# Altium schematic sheet Pulse_WS_MAX30105.SchDoc
size A4; SheetNumber: 1; SheetTotal: 1
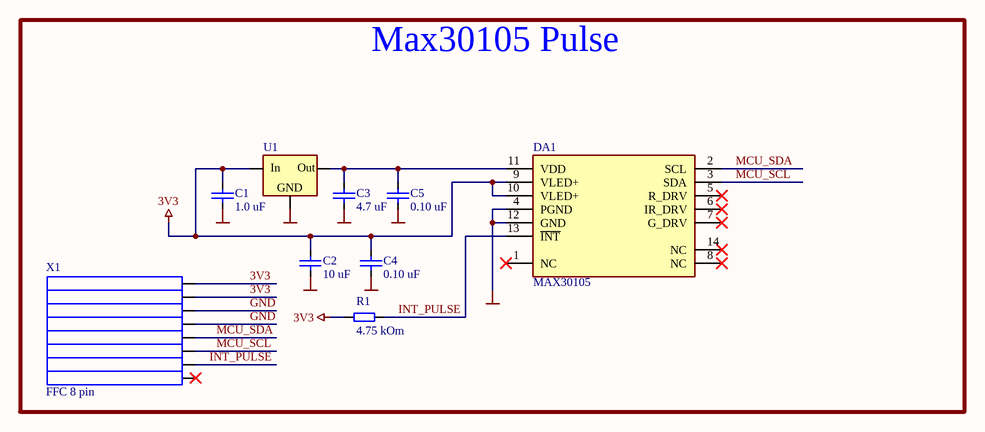
[diagram p0: Pulse_WS_MAX30105.SchDoc]

## Parts
C1  value 1.0 uF  [CAPC1608X90N]  (hidden comment: STD_CAP)
C2  value 10 uF  [CAPC2012X120N]  (hidden comment: STD_CAP)
C3  value 4.7 uF  [CAPC2012X120N]  (hidden comment: STD_CAP)
C4  value 0.10 uF  [CAPC1005X55N]  (hidden comment: STD_CAP)
C5  value 0.10 uF  [CAPC1005X55N]  (hidden comment: STD_CAP)
DA1  MAX30105  [MAX30105]
R1  value 4.75 kOm  [RESC1005X40N]  (hidden comment: STD_RES)
U1  XC6206P182MR  [SOT23]  (value not drawn)
X1  FFC 8 pin  [68710814022]

## Blocks framed on the sheet
Max30105 Pulse: C1-C5 DA1 R1 U1 X1

## Nets
3V3: C1.1 C2.1 C4.1 DA1.9(VLED+) DA1.10(VLED+) R1.1 U1.3 X1.1 X1.2
GND: C1.2 C2.2 C3.2 C4.2 C5.2 DA1.4(PGND) DA1.12(GND) U1.1 X1.3 X1.4
INT_PULSE: DA1.13(~{INT}) R1.2 X1.7
MCU_SCL: DA1.3(SDA) X1.6
MCU_SDA: DA1.2(SCL) X1.5
NetC3_1: C3.1 C5.1 DA1.11(VDD) U1.2

Not connected (* = marked no-connect by the designer): DA1 1(NC)* 5(R_DRV)* 6(IR_DRV)* 7(G_DRV)* 8(NC)* 14(NC)*; X1 8*

## Notes on the sheet
- (in symbol XC6206P182MR) In; Out; GND

## Library data of the parts
C1 = 3936: ManufacturerPartnumber: GRM188R71C105KA12D; Manufacturer: muRata; Number_Base: 3936; Comp_ID: 200004-0109; Lib_Description: Capacitor; Comp_Description: Capacitors 0603 1.0 uF ±10% 16V X7R; Human_Readable: Конденсатор 0603 1.0 uF ±10% 16V X7R; Precision: ±10%; Temp_Range: -55 to 125°C; Voltage_Range: 16V; Dielectric: X7R; Comp_Class_Number: 200004; Comp_Class_Name: Capacitors Chip SMD 0603; BOM: Конденсатор 0603 1.0 uF ±10% 16V X7R    GRM188R71C105KA12D muRata; Footprint_Description: Chip Capacitor EIA 0603. METRIC 1608, 2-Leads, Body 1,6x0,8mm, IPC Medium Density; HelpURL: \\corp1\RNDlibrary\_Library\Altium_lib\Datasheet\muRata\Chip_Monolithic_Ceramic_Capacitors\Chip_Monolithic_Ceramic_Capacitors.pdf; ComponentLink1Description: MANUFACTURER_URL; ComponentLink1URL: http://www.murata.com/products/catalog/pdf/c02e.pdf; Price: 0,0799999982118607; TimeModification_Comp: 06.12.2011 14:46:17
C2 = 4014: ManufacturerPartnumber: GRM21BR71A106KE51L; Manufacturer: muRata; Number_Base: 4014; Comp_ID: 200005-0069; Lib_Description: Capacitor; Comp_Description: Capacitors 0805 10 uF ±10% 10V X7R; Human_Readable: Конденсатор 0805 10 uF ±10% 10V X7R; Precision: ±10%; Temp_Range: -55 to 125°C; Voltage_Range: 10V; Dielectric: X7R; Comp_Class_Number: 200005; Comp_Class_Name: Capacitors Chip SMD 0805; BOM: Конденсатор 0805 10 uF ±10% 10V X7R    GRM21BR71A106KE51L muRata; Footprint_Description: Chip Capacitor EIA 0805. METRIC 2012, 2-Leads, Body 2,0x1,2mm, IPC Medium Density; HelpURL: \\corp1\RNDlibrary\_Library\Altium_lib\Datasheet\muRata\Chip_Monolithic_Ceramic_Capacitors\Chip_Monolithic_Ceramic_Capacitors.pdf; ComponentLink1Description: MANUFACTURER_URL; ComponentLink1URL: http://www.murata.com/products/catalog/pdf/c02e.pdf; TimeModification_Comp: 07.12.2011 12:55:51
C3 = 4013: ManufacturerPartnumber: GRM21BR71A475KA73L; Manufacturer: muRata; Number_Base: 4013; Comp_ID: 200005-0068; Lib_Description: Capacitor; Comp_Description: Capacitors 0805 4.7 uF ±10% 10V X7R; Human_Readable: Конденсатор 0805 4.7 uF ±10% 10V X7R; Precision: ±10%; Temp_Range: -55 to 125°C; Voltage_Range: 10V; Dielectric: X7R; Comp_Class_Number: 200005; Comp_Class_Name: Capacitors Chip SMD 0805; BOM: Конденсатор 0805 4.7 uF ±10% 10V X7R    GRM21BR71A475KA73L muRata; Footprint_Description: Chip Capacitor EIA 0805. METRIC 2012, 2-Leads, Body 2,0x1,2mm, IPC Medium Density; HelpURL: \\corp1\RNDlibrary\_Library\Altium_lib\Datasheet\muRata\Chip_Monolithic_Ceramic_Capacitors\Chip_Monolithic_Ceramic_Capacitors.pdf; ComponentLink1Description: MANUFACTURER_URL; ComponentLink1URL: http://www.murata.com/products/catalog/pdf/c02e.pdf; TimeModification_Comp: 07.12.2011 12:55:51
C4 C5 = 3823: ManufacturerPartnumber: GRM155R71C104KA88D; Manufacturer: muRata; Number_Base: 3823; Comp_ID: 200003-0422; Lib_Description: Capacitor; Comp_Description: Capacitors 0402 0.10 uF ±10% 16V X7R; Human_Readable: Конденсатор 0402 0.10 uF ±10% 16V X7R; Precision: ±10%; Temp_Range: -55 to 125°C; Voltage_Range: 16V; Dielectric: X7R; Comp_Class_Number: 200003; Comp_Class_Name: Capacitors Chip SMD 0402; AuthorModification_Comp: anosova; BOM: Конденсатор 0402 0.10 uF ±10% 16V X7R    GRM155R71C104KA88D muRata; Footprint_Description: Chip Capacitor EIA 0402. METRIC 1005, 2-Leads, Body 1,00x0,5mm, IPC Medium Density; HelpURL: \\corp1\RNDlibrary\_Library\Altium_lib\Datasheet\muRata\Chip_Monolithic_Ceramic_Capacitors\Chip_Monolithic_Ceramic_Capacitors.pdf; ComponentLink1Description: MANUFACTURER_URL; ComponentLink1URL: http://www.murata.com/products/catalog/pdf/c02e.pdf; Price: 0,0199999995529652; TimeModification_Comp: 18.11.2021 13:09:14
DA1 = MAX30105: Manufacturer: MAX; BOM: Датчик пульса    MPU-9250 MAX; Human_Readable: Датчик пульса; ComponentLink1Description: Help; ComponentLink1URL: D:\HSE\Трекер физ состояния\Help\MAX30105.pdf; HelpURL: D:\HSE\Трекер физ состояния\Help\MAX30105.pdf; ManufacturerPartnumber: MPU-9250; Footprint_Description: Custom
R1 = 2904: ManufacturerPartnumber: RC0402FR-074K75L; Manufacturer: Yageo; Number_Base: 2904; Comp_ID: 11010201-354; Lib_Description: Resistor; Comp_Description: Resistor 0402 1% E96 4.75 kOm; Human_Readable: Резистор 0402 1% E96 4,75 кОм; Precision: 1%; Temp_Range: -55 °C to +155 °C; Power_Range: 0.0625W; Comp_Class_Number: 11010201; Comp_Class_Name: Resistors Chip SMD 0402 1% E96; BOM: Резистор 0402 1% E96 4,75 кОм    RC0402FR-074K75L Yageo; Footprint_Description: Chip Resistor EIA 0402. METRIC 1005, 2-Leads, Body 1,00x0,5mm, IPC Medium Density; HelpURL: \\corp1\RNDlibrary\_Library\Altium_lib\Datasheet\Yageo\RC0402\PYu-RC0402_51_RoHS_L_6.pdf; ComponentLink1Description: MANUFACTURER_URL; ComponentLink1URL: http://www.yageo.com/documents/recent/PYu-RC0402_51_RoHS_L_6.pdf; Price: 0,00600000005215406; TimeModification_Comp: 06.12.2011 13:34:56
U1 = XC6206P182MR: LDO 1v8; Manufacturer: UMW; BOM: LDO 1V8    XC6206P182MR UMW; ManufacturerPartnumber: XC6206P182MR; Footprint_Description: SOT23; Human_Readable: LDO 1V8
X1 = FFC 8 pin: FFC connector 8 pin